# EAGLE design octanis_eps_compact (EAGLE 7.1.0)
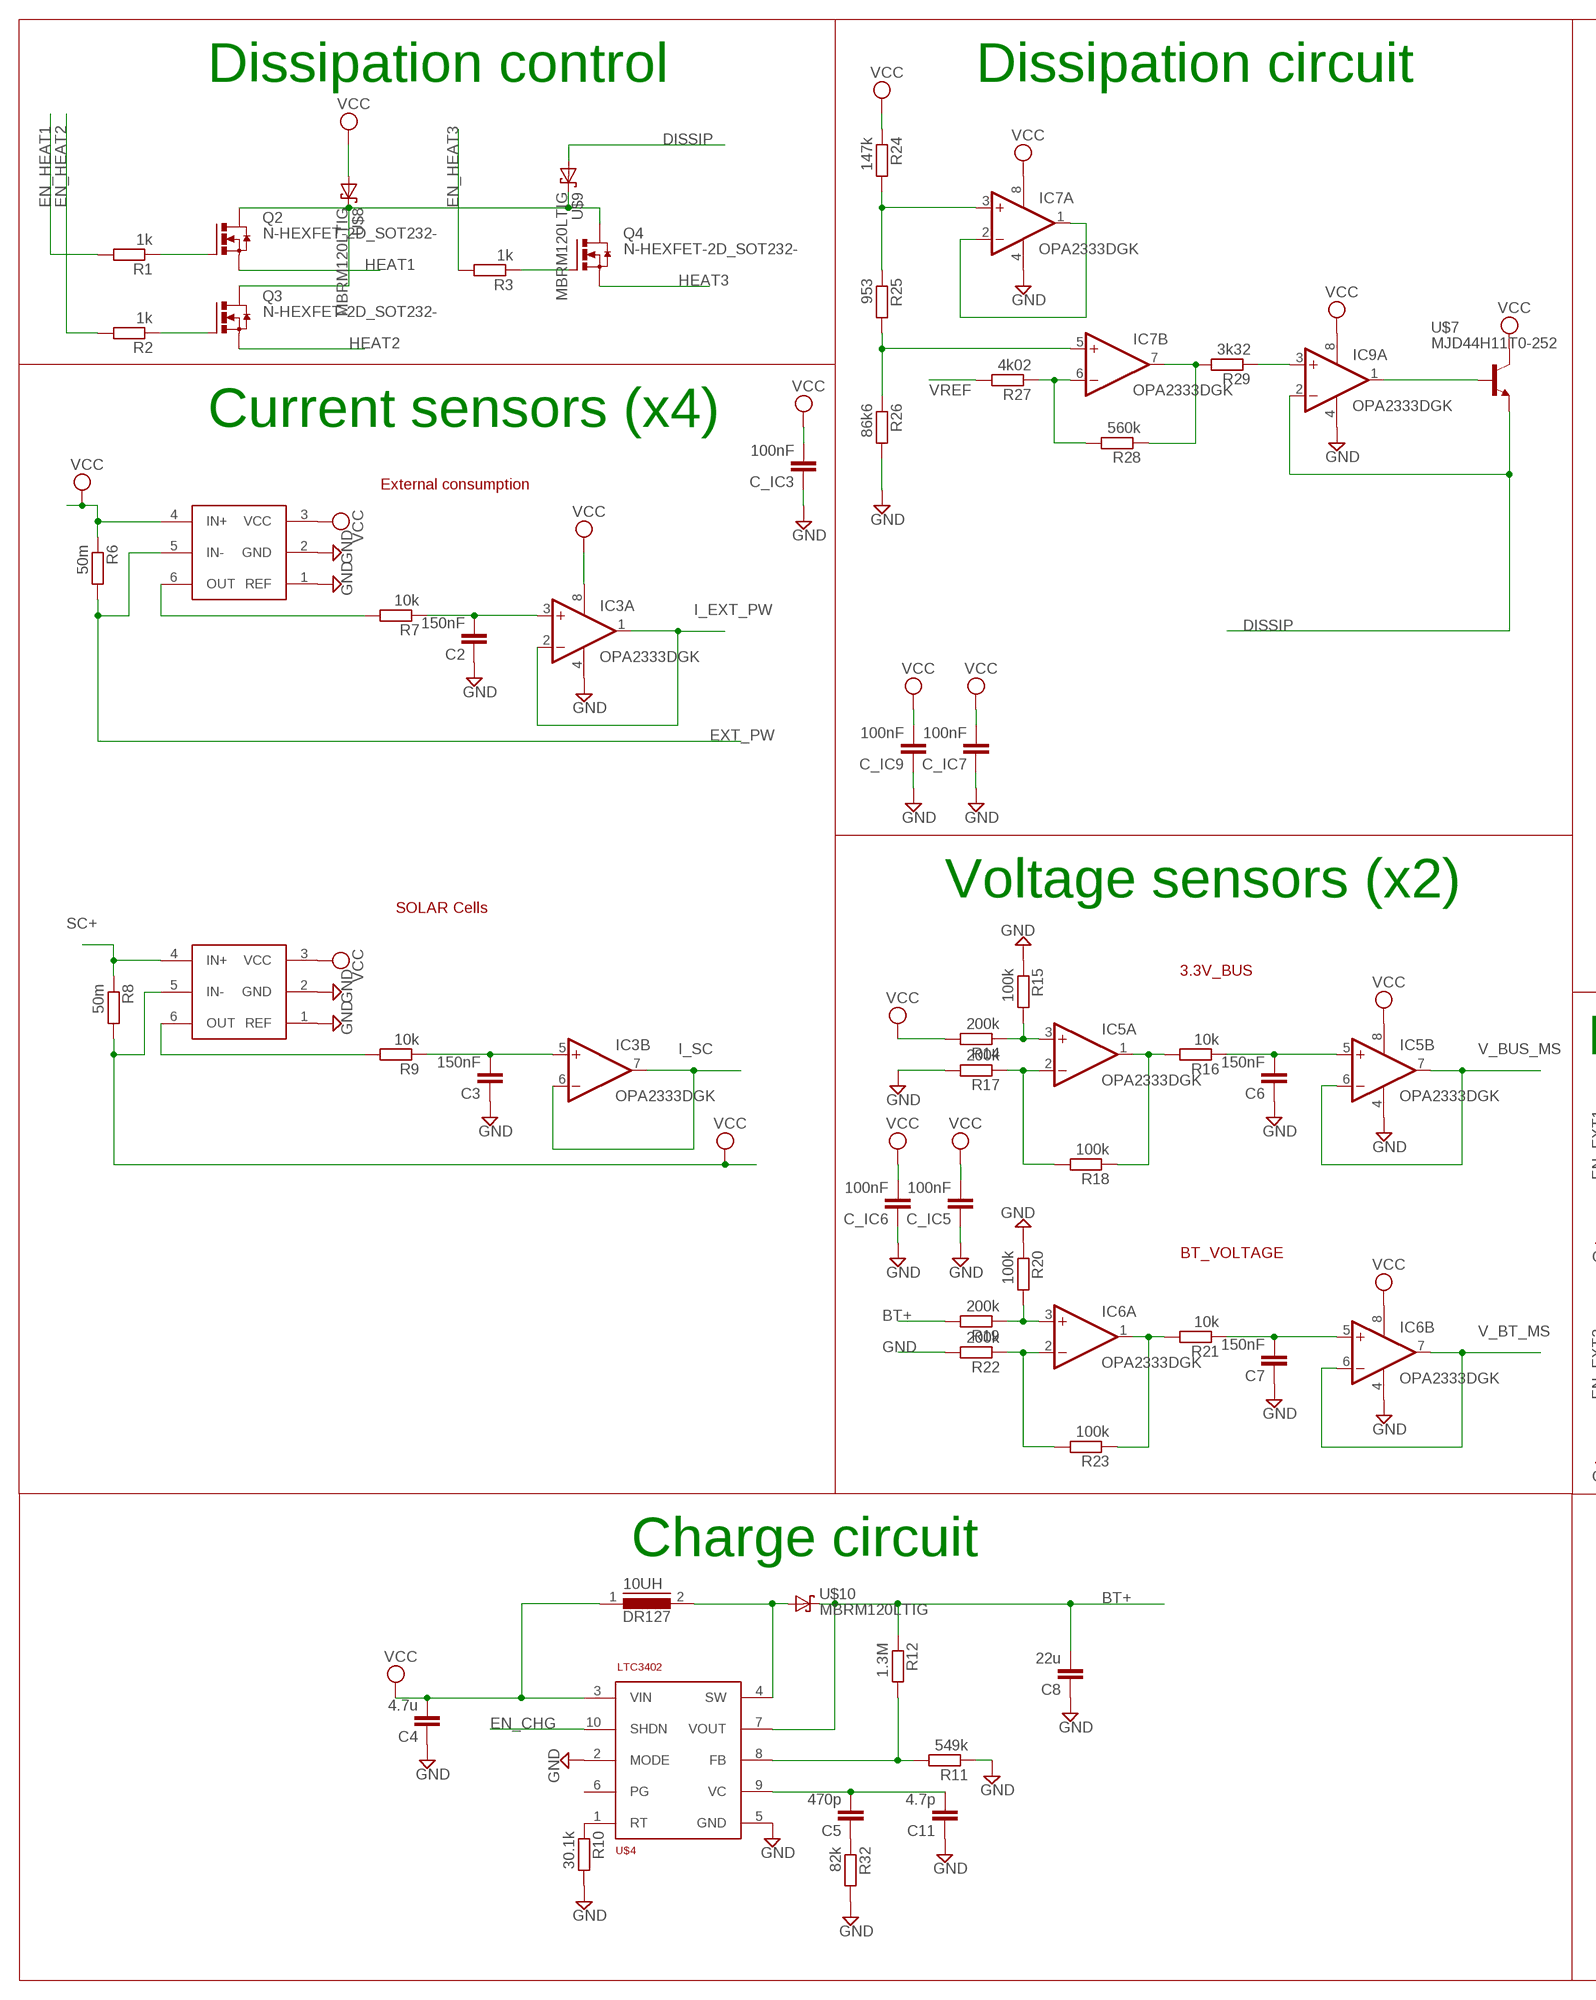
[diagram p0: schematic, sheet 1, part 1 of 2]
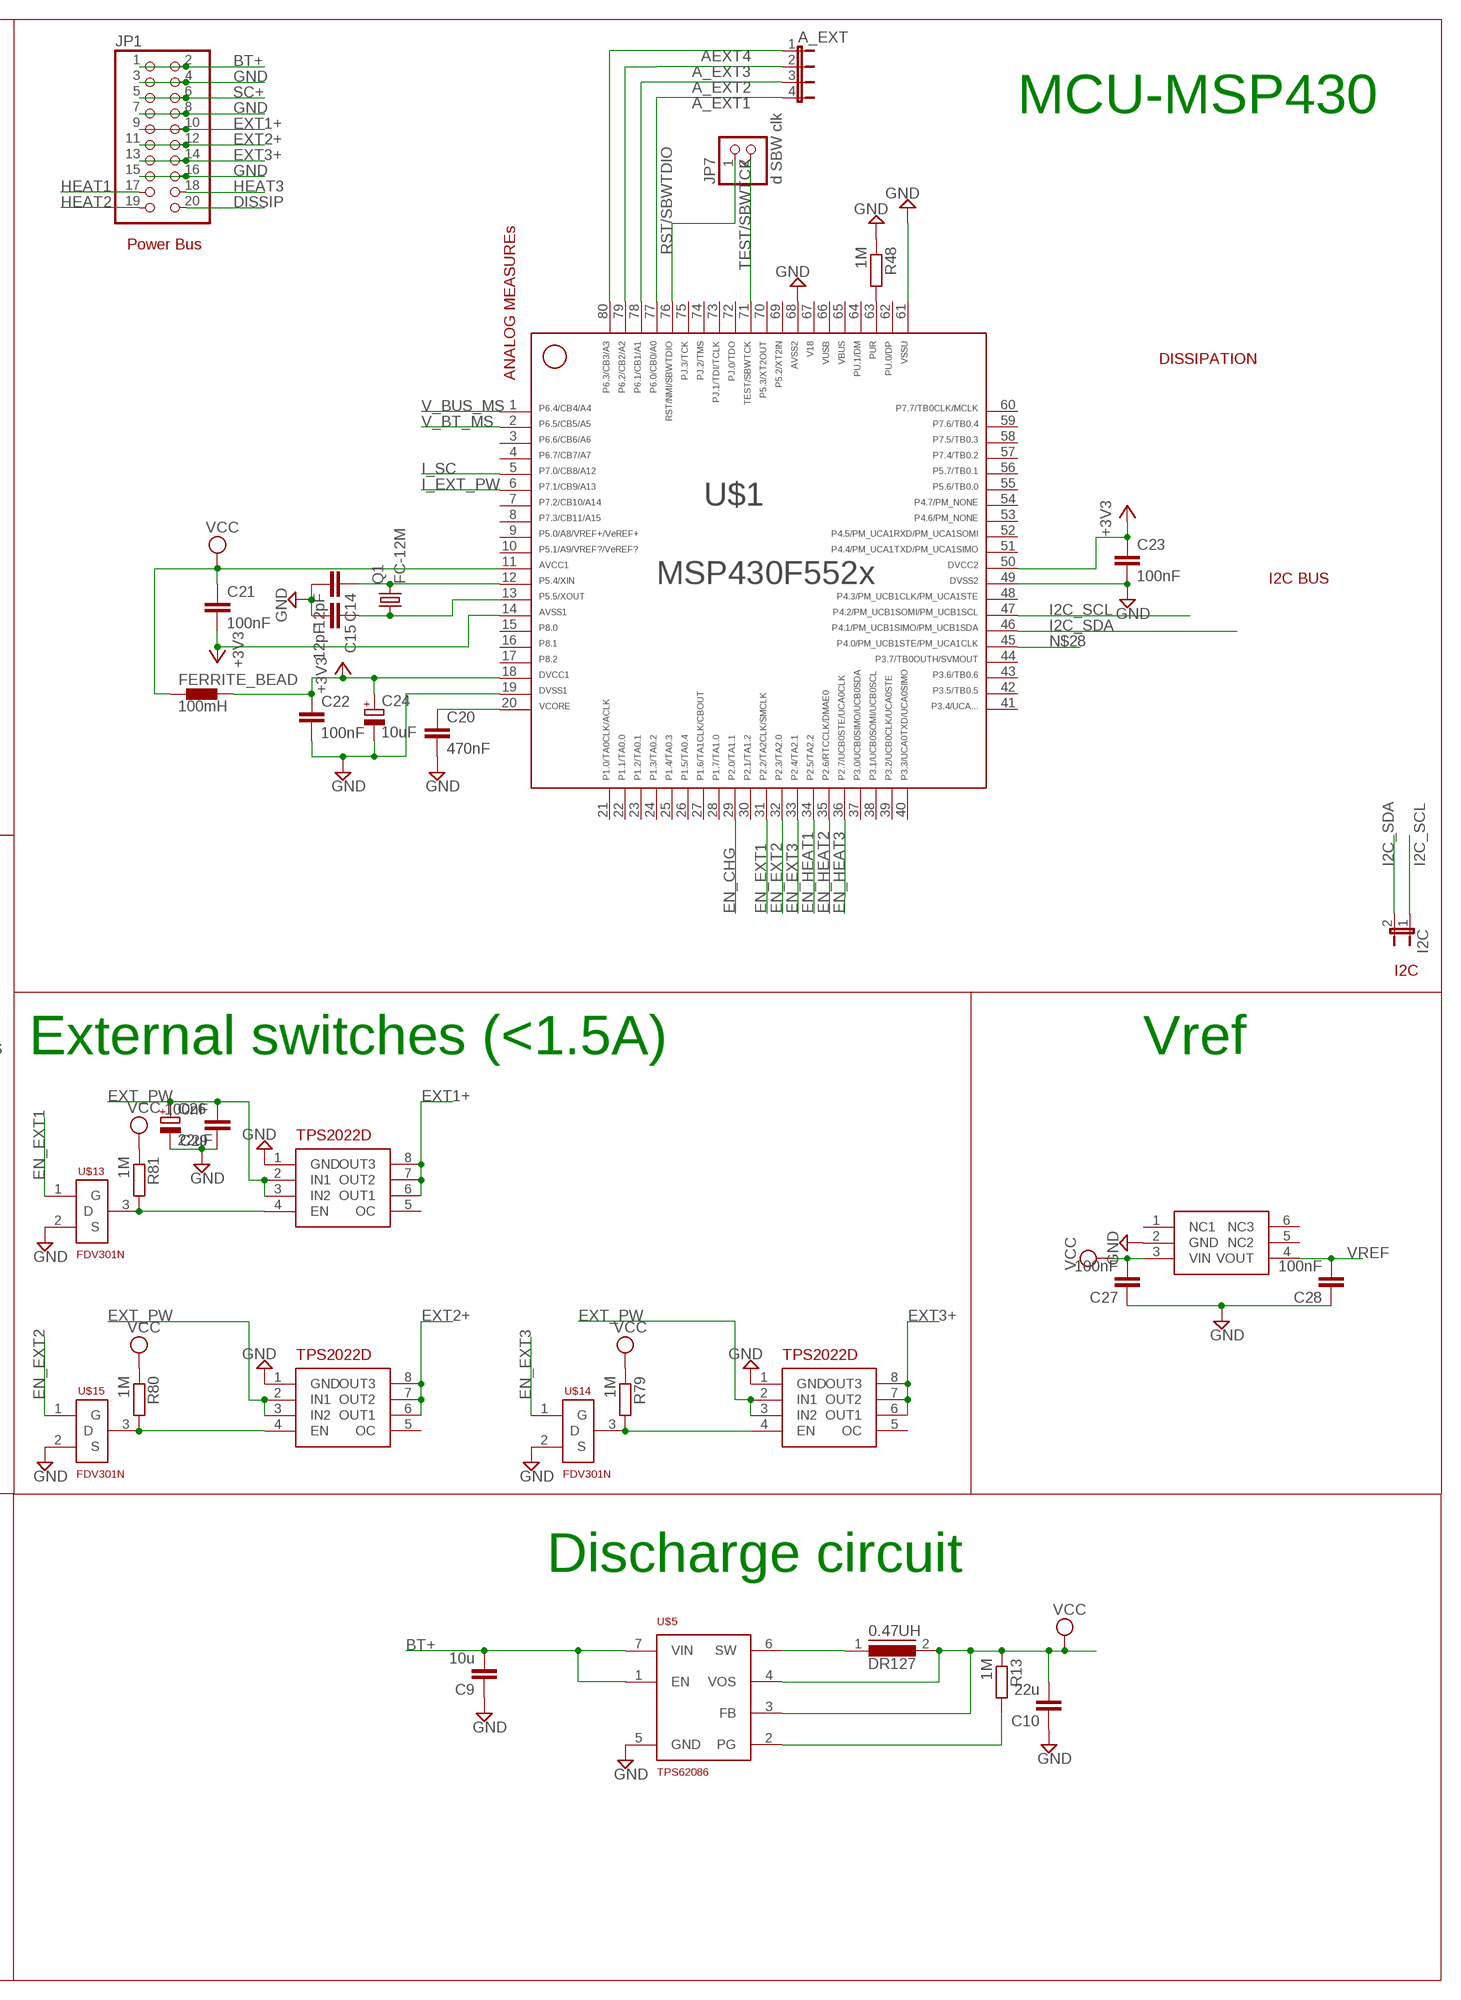
[diagram p1: schematic, sheet 1, part 2 of 2]

## Parts
0.47UH  DR127  [DR127]
10UH  DR127  [DR127]
A_EXT  JP4E  [JP4]
C2  150nF  C-EUC0603  [C0603]
C3  150nF  C-EUC0603  [C0603]
C4  4.7u  C-EUC1206  [C1206]
C5  470p  C-EUC0603  [C0603]
C6  150nF  C-EUC0603  [C0603]
C7  150nF  C-EUC0603  [C0603]
C8  22u  C-EUC0603  [C0603]
C9  10u  C-EUC1206  [C1206]
C10  22u  C-EUC1206  [C1206]
C11  4.7p  C-EUC0603  [C0603]
C14  12pF  C-EUC0603  [C0603]
C15  12pF  C-EUC0603  [C0603]
C20  470nF  C-EUC0603  [C0603]
C21  100nF  C-EUC0603  [C0603]
C22  100nF  C-EUC0603  [C0603]
C23  100nF  C-EUC0603  [C0603]
C24  10uF  CPOL-EUA/3216-18R  [A/3216-18R]
C26  22uF  CPOL-EUA/3216-18R  [A/3216-18R]
C27  100nF  C-EUC0603  [C0603]
C28  100nF  C-EUC0603  [C0603]
C29  100nF  C-EUC0603  [C0603]
C_IC3  100nF  C-EUC0603  [C0603]
C_IC5  100nF  C-EUC0603  [C0603]
C_IC6  100nF  C-EUC0603  [C0603]
C_IC7  100nF  C-EUC0603  [C0603]
C_IC9  100nF  C-EUC0603  [C0603]
FERRITE_BEAD  100mH  BLM15HD601SN1  [0402]
I2C  JP1E  [JP1]
IC3  OPA2333DGK  [MSOP08]
IC5  OPA2333DGK  [MSOP08]
IC6  OPA2333DGK  [MSOP08]
IC7  OPA2333DGK  [MSOP08]
IC9  OPA2333DGK  [MSOP08]
JP1  PINHD-2X10  [2X10]
JP7  d SBW clk  PINHD-1X2  [1X02]
Q1  FC-12M  [FC-12M]
Q2  N-HEXFET-2D_SOT232-  [SOT223]
Q3  N-HEXFET-2D_SOT232-  [SOT223]
Q4  N-HEXFET-2D_SOT232-  [SOT223]
R1  1k  R-EU_R0603  [R0603]
R2  1k  R-EU_R0603  [R0603]
R3  1k  R-EU_R0603  [R0603]
R6  50m  R-EU_R1206  [R1206]
R7  10k  R-EU_R0603  [R0603]
R8  50m  R-EU_R1206  [R1206]
R9  10k  R-EU_R0603  [R0603]
R10  30.1k  R-EU_R0603  [R0603]
R11  549k  R-EU_R0603  [R0603]
R12  1.3M  R-EU_R0603  [R0603]
R13  1M  R-EU_R0603  [R0603]
R14  200k  R-EU_R0603  [R0603]
R15  100k  R-EU_R0603  [R0603]
R16  10k  R-EU_R0603  [R0603]
R17  200k  R-EU_R0603  [R0603]
R18  100k  R-EU_R0603  [R0603]
R19  200k  R-EU_R0603  [R0603]
R20  100k  R-EU_R0603  [R0603]
R21  10k  R-EU_R0603  [R0603]
R22  200k  R-EU_R0603  [R0603]
R23  100k  R-EU_R0603  [R0603]
R24  147k  R-EU_R0603  [R0603]
R25  953  R-EU_R0603  [R0603]
R26  86k6  R-EU_R0603  [R0603]
R27  4k02  R-EU_R0603  [R0603]
R28  560k  R-EU_R0603  [R0603]
R29  3k32  R-EU_R0603  [R0603]
R32  82k  R-EU_R0603  [R0603]
R48  1M  R-EU_R0603  [R0603]
R79  1M  R-EU_R0603  [R0603]
R80  1M  R-EU_R0603  [R0603]
R81  1M  R-EU_R0603  [R0603]
U$1  F552X---PN80  [PN80]
U$2  INA213  [SC70-6]
U$3  INA213  [SC70-6]
U$4  LTC3402  [MSOP10]
U$5  TPS62086  [QFN-7]
U$7  MJD44H11T0-252  [TO252]
U$8  MBRM120LTIG  [DO216AA]
U$9  MBRM120LTIG  [DO216AA]
U$10  MBRM120LTIG  [DO216AA]
U$13  FDV301N  [SOT23]
U$14  FDV301N  [SOT23]
U$15  FDV301N  [SOT23]
U$16  TPS2022D  [SO8]
U$17  TPS2022D  [SO8]
U$18  TPS2022D  [SO8]
U$19  ADR127B  [TSOT23-6]

## Nets
+3V3: C21.2 C22.1 C23.1 C24.+ FERRITE_BEAD.2 U$1.14 U$1.18 U$1.50
A_EXT1: A_EXT.4 U$1.77
A_EXT2: A_EXT.3 U$1.78
A_EXT3: A_EXT.2 U$1.79
AEXT4: A_EXT.1 U$1.80
BT+: C8.2 C9.2 JP1.1 JP1.2 R12.1 R19.2 U$4.7(VOUT) U$5.1(EN) U$5.7(VIN) U$10.C(K)
DISSIP: IC9.2(A:-IN) JP1.20 U$7.3(E) U$9.A
EN_CHG: U$1.29 U$4.10(SHDN)
EN_EXT1: U$1.31 U$13.1(G)
EN_EXT2: U$1.32 U$15.1(G)
EN_EXT3: U$1.33 U$14.1(G)
EN_HEAT1: R1.2 U$1.34
EN_HEAT2: R2.2 U$1.35
EN_HEAT3: R3.2 U$1.36
EXT1+: JP1.9 JP1.10 U$16.6(OUT1) U$16.7(OUT2) U$16.8(OUT3)
EXT2+: JP1.11 JP1.12 U$17.6(OUT1) U$17.7(OUT2) U$17.8(OUT3)
EXT3+: JP1.13 JP1.14 U$18.6(OUT1) U$18.7(OUT2) U$18.8(OUT3)
EXT_PW: C26.+ C29.2 R6.2 U$2.5(IN-) U$16.2(IN1) U$16.3(IN2) U$17.2(IN1) U$17.3(IN2) U$18.2(IN1) U$18.3(IN2)
GND: C2.1 C3.1 C4.1 C6.1 C7.1 C8.1 C9.1 C10.1 C11.1 C14.2 C15.2 C20.2 C22.2 C23.2 C24.- C26.- C27.1 C28.1 C29.1 C_IC3.1 C_IC5.1 C_IC6.1 C_IC7.1 C_IC9.1 IC3.4(P:V-) IC5.4(P:V-) IC6.4(P:V-) IC7.4(P:V-) IC9.4(P:V-) JP1.3 JP1.4 JP1.7 JP1.8 JP1.15 JP1.16 R10.2 R11.1 R15.1 R17.2 R20.1 R22.2 R26.2 R32.2 R48.1 U$1.19 U$1.49 U$1.61 U$1.68 U$2.1(REF) U$2.2(GND) U$3.1(REF) U$3.2(GND) U$4.2(MODE) U$4.5(GND) U$5.5(GND) U$13.2(S) U$14.2(S) U$15.2(S) U$16.1(GND) U$17.1(GND) U$18.1(GND) U$19.2(GND)
HEAT1: JP1.17 Q2.3(S)
HEAT2: JP1.19 Q3.3(S)
HEAT3: JP1.18 Q4.3(S)
I2C_SCL: I2C.1 U$1.47
I2C_SDA: I2C.2 U$1.46
I_EXT_PW: IC3.1(A:OUT) IC3.2(A:-IN) U$1.6
I_SC: IC3.6(B:-IN) IC3.7(B:OUT) U$1.5
N$1: R7.2 U$2.6(OUT)
N$2: R9.2 U$3.6(OUT)
N$3: R10.1 U$4.1(RT)
N$4: C5.1 R32.1
N$5: Q2.2(D) Q2.4(D) Q3.2(D) Q3.4(D) Q4.2(D) Q4.4(D) U$8.C(K) U$9.C(K)
N$6: C2.2 IC3.3(A:+IN) R7.1
N$7: C3.2 IC3.5(B:+IN) R9.1
N$8: C5.2 C11.2 U$4.9(VC)
N$9: C7.2 IC6.5(B:+IN) R21.1
N$10: IC6.1(A:OUT) R21.2 R23.1
N$11: C6.2 IC5.5(B:+IN) R16.1
N$12: IC5.1(A:OUT) R16.2 R18.1
N$13: IC5.2(A:-IN) R17.1 R18.2
N$14: IC5.3(A:+IN) R14.1 R15.2
N$15: IC6.2(A:-IN) R22.1 R23.2
N$16: IC6.3(A:+IN) R19.1 R20.2
N$17: IC7.1(A:OUT) IC7.2(A:-IN)
N$18: IC7.3(A:+IN) R24.2 R25.1
N$19: IC7.5(B:+IN) R25.2 R26.1
N$20: IC7.6(B:-IN) R27.1 R28.2
N$21: IC7.7(B:OUT) R28.1 R29.2
N$22: IC9.3(A:+IN) R29.1
N$23: R11.2 R12.2 U$4.8(FB)
N$24: 10UH.2 U$4.4(SW) U$10.A
N$25: R13.2 U$5.2(PG)
N$26: 0.47UH.1 U$5.6(SW)
N$27: R48.2 U$1.63
N$28: U$1.45
N$29: Q2.1(G) R1.1
N$31: Q3.1(G) R2.1
N$34: R80.2 U$15.3(D) U$17.4(EN)
N$37: Q4.1(G) R3.1
N$45: IC9.1(A:OUT) U$7.1(B)
N$48: C14.1 Q1.2 U$1.12
N$49: C20.1 U$1.20
N$50: C15.1 Q1.1 U$1.13
N$79: R81.2 U$13.3(D) U$16.4(EN)
N$80: R79.2 U$14.3(D) U$18.4(EN)
RST/SBWTDIO: JP7.1 U$1.76
SC+: JP1.5 JP1.6 R8.1 U$3.4(IN+)
TEST/SBWTCK: JP7.2 U$1.71
V_BT_MS: IC6.6(B:-IN) IC6.7(B:OUT) U$1.2
V_BUS_MS: IC5.6(B:-IN) IC5.7(B:OUT) U$1.1
VCC: 0.47UH.2 10UH.1 C4.2 C10.2 C21.1 C27.2 C_IC3.2 C_IC5.2 C_IC6.2 C_IC7.2 C_IC9.2 FERRITE_BEAD.1 IC3.8(P:V+) IC5.8(P:V+) IC6.8(P:V+) IC7.8(P:V+) IC9.8(P:V+) R6.1 R8.2 R13.1 R14.2 R24.1 R79.1 R80.1 R81.1 U$1.11 U$2.3(VCC) U$2.4(IN+) U$3.3(VCC) U$3.5(IN-) U$4.3(VIN) U$5.3(FB) U$5.4(VOS) U$7.2(C) U$8.A U$19.3(VIN)
VREF: C28.2 R27.2 U$19.4(VOUT)
Unconnected: IC9.5(B:+IN) IC9.6(B:-IN) IC9.7(B:OUT) U$1.3 U$1.4 U$1.7 U$1.8 U$1.9 U$1.10 U$1.15 U$1.16 U$1.17 U$1.21 U$1.22 U$1.23 U$1.24 U$1.25 U$1.26 U$1.27 U$1.28 U$1.30 U$1.37 U$1.38 U$1.39 U$1.40 U$1.41 U$1.42 U$1.43 U$1.44 U$1.48 U$1.51 U$1.52 U$1.53 U$1.54 U$1.55 U$1.56 U$1.57 U$1.58 U$1.59 U$1.60 U$1.62 U$1.64 U$1.69 U$1.70 U$1.72 U$1.73 U$1.74 U$1.75 U$4.6(PG) U$16.5(OC) U$17.5(OC) U$18.5(OC) U$19.1(NC1) U$19.5(NC2) U$19.6(NC3)

## Notes on the sheet
- Dissipation control | Dissipation circuit
- MCU-MSP430
- Power Bus
- DISSIPATION
- ANALOG MEASUREs
- Current sensors (x4)
- External consumption
- I2C BUS
- Voltage sensors (x2)
- SOLAR Cells
- 3.3V_BUS | I2C
- External switches (<1.5A) | Vref
- BT_VOLTAGE
- Charge circuit | Discharge circuit

## Power pins joined to a net without a drawn wire
65: U$1.65
66: U$1.66
67: U$1.67

## Library data of the parts
0.47UH 10UH = inductors:DR127: High Power Density, High Efficiency, Shielded Inductors Source: coiltronics_dr_series.pdf
A_EXT = jumper:JP4E: JUMPER
C2-C11 C14 C15 C20-C23 C27-C29 C_IC3 C_IC5-C_IC7 C_IC9 = rcl:C-EU: CAPACITOR, European symbol
C24 C26 = rcl:CPOL-EU: POLARIZED CAPACITOR, European symbol
FERRITE_BEAD = inductors:BLM15H: EMIFIL (R) Chip Ferrite Bead for GHz Noise Source: http://www.murata.com/ Ferrite Bead BLM15H.pdf
I2C = jumper:JP1E: JUMPER
IC3 IC5-IC7 IC9 = linear:OPA2333: DUAL 1.8V, microPOWER CMOS OPERATIONAL AMPLIFIERS Zerø-Drift Series Source: Texas Instruments (Burr-Brown) .. U11 opa333 Operational Amp.pdf
JP1 = pinhead:PINHD-2X10: PIN HEADER
JP7 = pinhead:PINHD-1X2: PIN HEADER
Q1 = crystal:FC-12M: kHz RANGE CRYSTAL UNIT LOW PROFILE SMD Source: Epson Toyocom FC-12M.pdf
Q2-Q4 = transistor-power:N-HEXFET-2D_?-*: HEXFET® Power MOSFET 2 Drain connects http://www.irf.com/product-info/datasheets/data/irll014n.pdf
R1-R3 R6-R29 R32 R48 R79-R81 = rcl:R-EU_: RESISTOR, European symbol
U$1 = TI_MSP430_v16:F552X---PN80: ***MSP430F552X***PN80 http://www.ti.com/lit/gpn/msp430f5529 Rev1.0 06/2010 For F552X where X is 1,5,7,9
U$2 U$3 = Octanis1_EPS:INA213: Voltage Output, High or Low Side Measurement, Bi-Directional Zer ø -Drift Series Current-Shunt Monitor
U$4 = Octanis1_EPS:LTC3402: 1 LTC3402 3402fb 2A, 3MHz Micropower Synchronous Boost Converter
U$5 = Octanis1_EPS:TPS62086: 3-A Step-Down Converter with Hiccup Short Circuit Protection in 2x2 QFN Package Fixed 3.3V operation
U$7 = Octanis1_EPS:MJD44H11: MJD44H11, MJD45H11 Complementary power transistors
U$8-U$10 = Octanis1_EPS:MBRM120LTIG
U$13-U$15 = Octanis1_EPS:FDV301N: FDV301N Digital FET ,N-Channel
U$16-U$18 = Octanis1_EPS:TPS2022D: TEXAS INSTRUMENTS - TPS2022D - IC, 1.5A PWR DIST SWITCH 8SOIC
U$19 = Octanis1_EPS:ADR127B: ANALOG DEVICES - ADR127BUJZ-REEL7 - VOLTAGE REFERENCE, SERIES, 3.3V, TSOT-6

## Net classes
0 default: clearance 0.205 mm

## Board
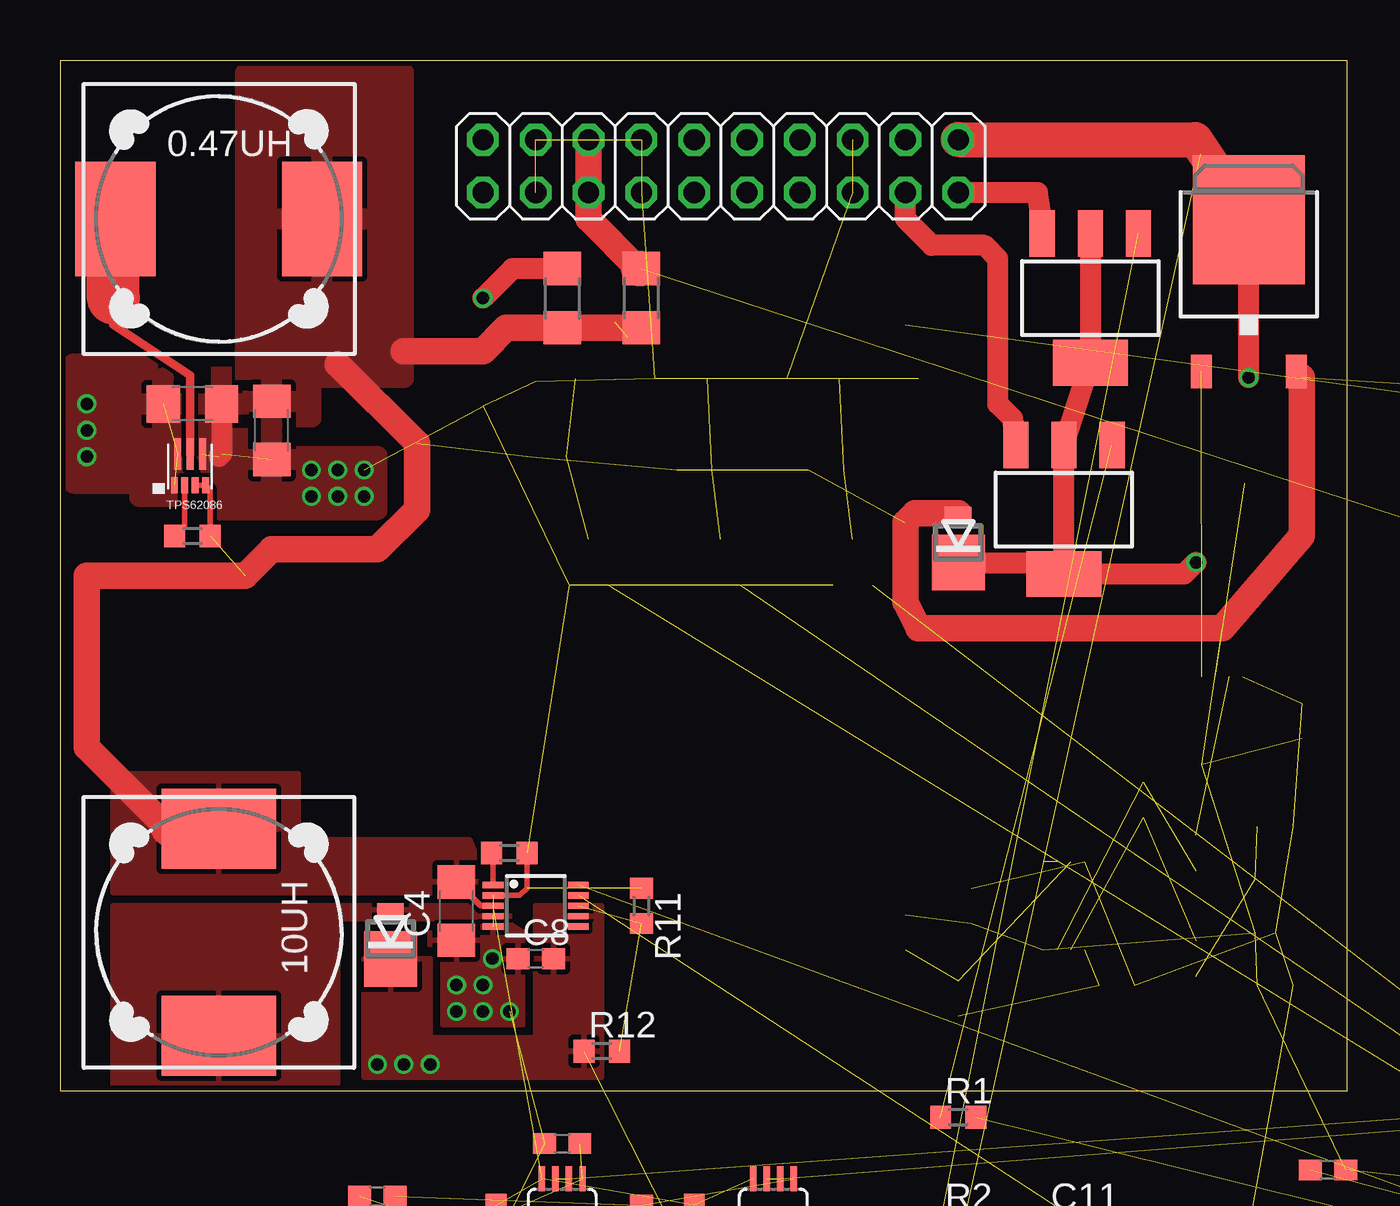
[diagram p2: board, top side]
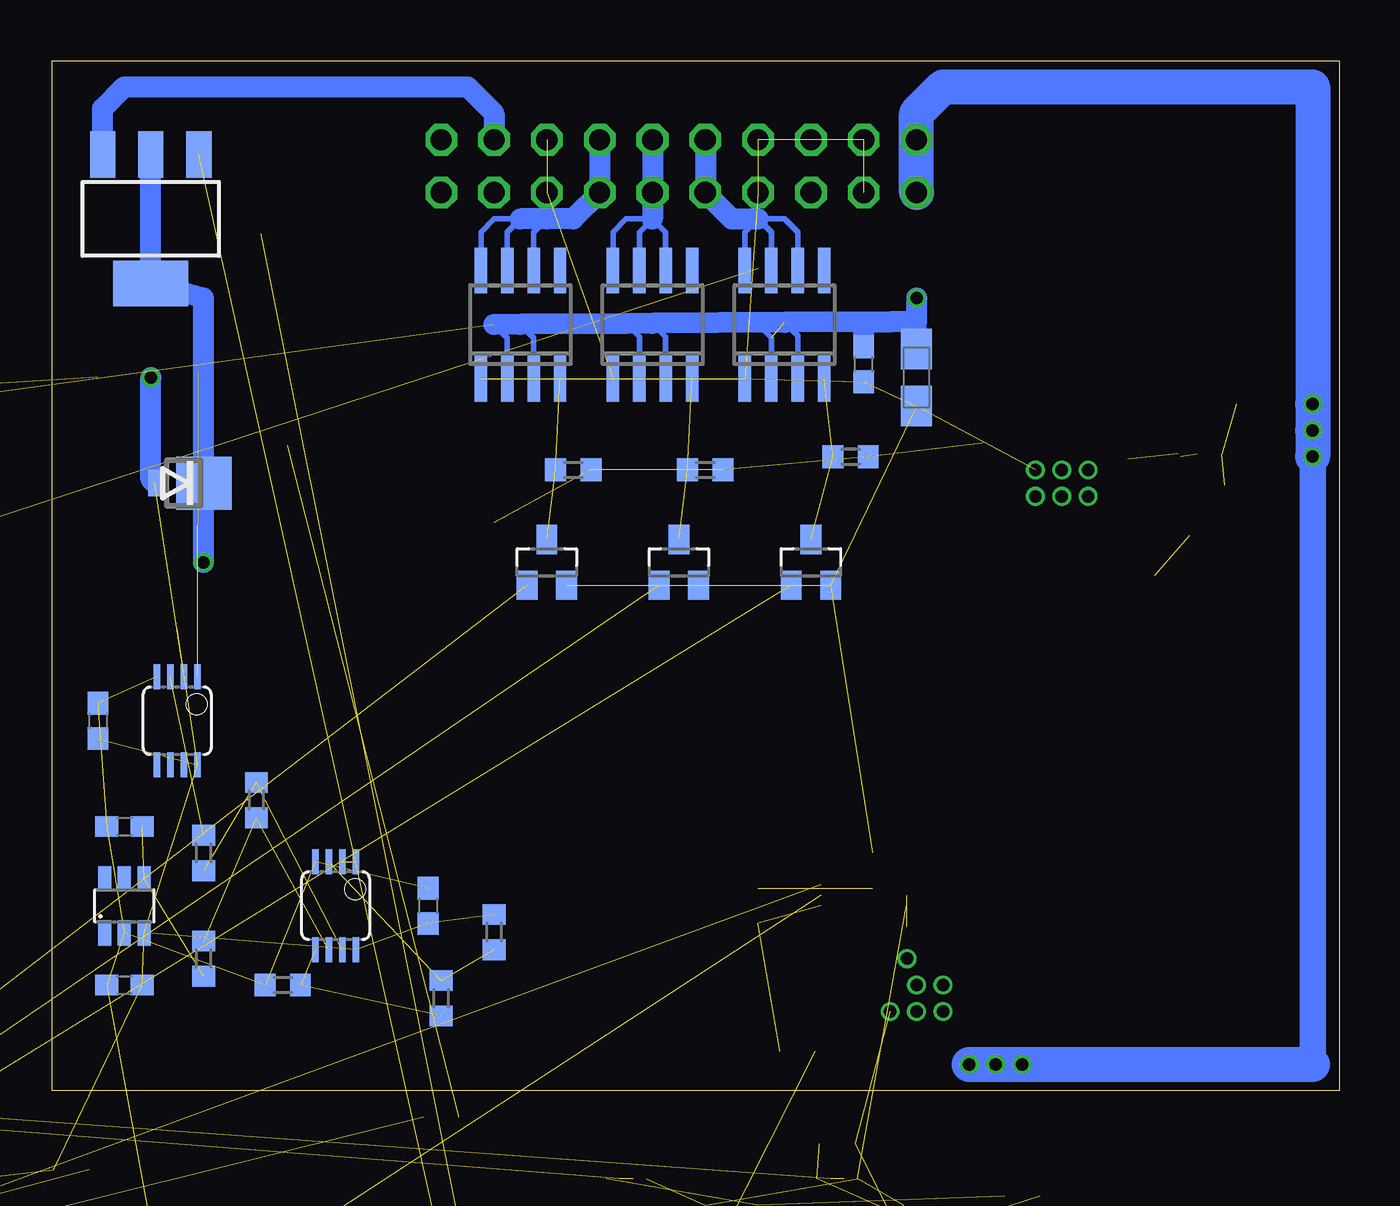
[diagram p3: board, bottom side, seen from below]

Size 61.9 x 49.52 mm. Coordinates in mm from the lower left corner, seen from the top.
Outline: 0,0 61.9,0 61.9,49.52 0,49.52 0,0
Copper layers (1*2*15*16): Top 0.035mm / dielectric 0.2mm / layer 2 0.0175mm / dielectric 1.1mm / layer 15 0.0175mm / dielectric 0.2mm / Bottom 0.035mm
Design rules "SeeedStudio_DRU_no_angle_20130527": minimum track width 6mil, minimum drill 12mil, track to track 6mil, track to pad 6mil, pad to pad 6mil, via to via 6mil, smd to smd 0mil, copper to edge 10mil, drill to drill 10mil, minimum pad ring 6mil, minimum via ring 6mil, stop-mask expansion 2mil, vias tented up to drill 25mil, thermal gap 10mil

### Footprints (pad centres in the part's own frame; a part is rotated, then mirrored left to right if it is on the bottom)
DR127 = smd 3.85 x 5.5: 1 -4.975,0; 2 4.975,0
JP4 = drill 0.914 long: 1 -3.81,0; 2 -1.27,0; 3 1.27,0; 4 3.81,0
C0603 = smd 1.1 x 1: 1 -0.85,0; 2 0.85,0
C1206 = smd 1.6 x 1.8: 1 -1.4,0; 2 1.4,0
A/3216-18R = smd 1.95 x 1.5: + 1.375,0; - -1.375,0
0402 = smd 0.7 x 0.9: 1 -0.65,0; 2 0.65,0
JP1 = drill 0.914 long: 1 0,-1.27; 2 0,1.27
MSOP08 = smd 0.3 x 1.2: 1 -0.976,-2.113; 2 -0.326,-2.113; 3 0.324,-2.113; 4 0.974,-2.113; 5 0.974,2.112; 6 0.324,2.112; 7 -0.326,2.112; 8 -0.976,2.112
2X10 = drill 1.016 octagon: 1 -11.43,-1.27; 2 -11.43,1.27; 3 -8.89,-1.27; 4 -8.89,1.27; 5 -6.35,-1.27; 6 -6.35,1.27; 7 -3.81,-1.27; 8 -3.81,1.27; 9 -1.27,-1.27; 10 -1.27,1.27; 11 1.27,-1.27; 12 1.27,1.27; 13 3.81,-1.27; 14 3.81,1.27; 15 6.35,-1.27; 16 6.35,1.27; 17 8.89,-1.27; 18 8.89,1.27; 19 11.43,-1.27; 20 11.43,1.27
1X02 = drill 1.016 long: 1 -1.27,0; 2 1.27,0
FC-12M = smd 0.7 x 1.4: 1 -0.85,0; 2 0.85,0
SOT223 = smd 1.219 x 2.235: 1 -2.311,-3.099; 2 0,-3.099; 3 2.311,-3.099 | smd 3.6 x 2.2: 4 0,3.099
R0603 = smd 1 x 1.1: 1 -0.85,0; 2 0.85,0
R1206 = smd 1.6 x 1.803: 1 -1.422,0; 2 1.422,0
PN80 = smd 1.35 x 0.3: 1 -6.825,4.75; 2 -6.825,4.25; 3 -6.825,3.75; 4 -6.825,3.25; 5 -6.825,2.75; 6 -6.825,2.25; 7 -6.825,1.75; 8 -6.825,1.25; 9 -6.825,0.75; 10 -6.825,0.25; 11 -6.825,-0.25; 12 -6.825,-0.75; 13 -6.825,-1.25; 14 -6.825,-1.75; 15 -6.825,-2.25; 16 -6.825,-2.75; 17 -6.825,-3.25; 18 -6.825,-3.75; 19 -6.825,-4.25; 20 -6.825,-4.75; 41 6.825,-4.75; 42 6.825,-4.25; 43 6.825,-3.75; 44 6.825,-3.25; 45 6.825,-2.75; 46 6.825,-2.25; 47 6.825,-1.75; 48 6.825,-1.25; 49 6.825,-0.75; 50 6.825,-0.25; 51 6.825,0.25; 52 6.825,0.75; 53 6.825,1.25; 54 6.825,1.75; 55 6.825,2.25; 56 6.825,2.75; 57 6.825,3.25; 58 6.825,3.75; 59 6.825,4.25; 60 6.825,4.75 | smd 0.3 x 1.35: 21 -4.75,-6.825; 22 -4.25,-6.825; 23 -3.75,-6.825; 24 -3.25,-6.825; 25 -2.75,-6.825; 26 -2.25,-6.825; 27 -1.75,-6.825; 28 -1.25,-6.825; 29 -0.75,-6.825; 30 -0.25,-6.825; 31 0.25,-6.825; 32 0.75,-6.825; 33 1.25,-6.825; 34 1.75,-6.825; 35 2.25,-6.825; 36 2.75,-6.825; 37 3.25,-6.825; 38 3.75,-6.825; 39 4.25,-6.825; 40 4.75,-6.825; 61 4.75,6.825; 62 4.25,6.825; 63 3.75,6.825; 64 3.25,6.825; 65 2.75,6.825; 66 2.25,6.825; 67 1.75,6.825; 68 1.25,6.825; 69 0.75,6.825; 70 0.25,6.825; 71 -0.25,6.825; 72 -0.75,6.825; 73 -1.25,6.825; 74 -1.75,6.825; 75 -2.25,6.825; 76 -2.75,6.825; 77 -3.25,6.825; 78 -3.75,6.825; 79 -4.25,6.825; 80 -4.75,6.825
SC70-6 = smd 0.35 x 0.8: 1 -0.65,-0.95; 2 0,-0.95; 3 0.65,-0.95; 4 0.65,0.95; 5 0,0.95; 6 -0.65,0.95
MSOP10 = smd 0.3 x 1: 1 -1,-2.05; 2 -0.5,-2.05; 3 0,-2.05; 4 0.5,-2.05; 5 1,-2.05; 6 1,2.05; 7 0.5,2.05; 8 0,2.05; 9 -0.5,2.05; 10 -1,2.05
QFN-7 = smd 0.33 x 0.762: 1 1.501,0.102; 2 1.001,0.102; 3 0.5,0.102; 4 0,0.102 | smd 0.33 x 1.524: 5 0.15,-1.397; 6 0.749,-1.397; 7 1.349,-1.397
TO252 = smd 1 x 1.6: 1 -2.28,-4.8; 2 2.28,-4.8 | smd 5.4 x 6.2: 3 0,2.5
DO216AA = smd 0.635 x 1.27: A 2.349,0 | smd 2.667 x 2.54: C -0.01,0
SOT23 = smd 1 x 1.4: 1 -0.95,-1.1; 2 0.95,-1.1; 3 0,1.1
SO8 = smd 0.6 x 2.2: 1 -1.905,-2.6; 2 -0.635,-2.6; 3 0.635,-2.6; 4 1.905,-2.6; 5 1.905,2.6; 6 0.635,2.6; 7 -0.635,2.6; 8 -1.905,2.6
TSOT23-6 = smd 0.62 x 1.22: 1 -0.95,-1.3; 2 0,-1.3; 3 0.95,-1.3; 4 0.95,1.3; 5 0,1.3; 6 -0.95,1.3

### Placement (x,y rotation side)
0.47UH  7.62,41.91 0 top
10UH  7.62,7.62 270 top
A_EXT  95.25,26.67 90 top  (outside the outline)
C2  92.71,22.86 270 bottom  (outside the outline)
C3  88.9,12.7 270 bottom  (outside the outline)
C4  19.05,8.64 90 top
C5  49.53,-10.16 0 top  (outside the outline)
C6  24.13,-2.54 0 top
C7  15.24,-5.08 0 top  (outside the outline)
C8  22.86,6.35 0 top
C9  6.35,33.02 180 top
C10  10.16,31.75 90 top
C11  48.26,-6.35 0 top  (outside the outline)
C14  72.39,-3.81 180 top  (outside the outline)
C15  71.12,-6.35 180 top  (outside the outline)
C20  76.2,-12.7 270 top  (outside the outline)
C21  60.96,-3.81 180 top  (outside the outline)
C22  71.12,-10.16 180 top  (outside the outline)
C23  96.52,-7.62 270 top  (outside the outline)
C24  73.66,-11.43 90 top  (outside the outline)
C26  20.32,34.29 90 bottom
C27  58.42,5.08 0 bottom
C28  58.42,12.7 0 bottom
C29  22.86,34.92 90 bottom
C_IC3  90.17,41.91 0 bottom  (outside the outline)
C_IC5  20.95,-6.35 90 top  (outside the outline)
C_IC6  30.48,-6.35 90 top  (outside the outline)
C_IC7  43.81,8.89 270 bottom
C_IC9  59.69,17.78 270 bottom
FERRITE_BEAD  67.31,-5.08 270 top  (outside the outline)
I2C  96.52,11.43 0 top  (outside the outline)
IC3  90.17,35.56 270 bottom  (outside the outline)
IC5  24.13,-6.35 0 top  (outside the outline)
IC6  34.29,-6.35 0 top  (outside the outline)
IC7  48.26,8.89 180 bottom
IC9  55.88,17.78 180 bottom
JP1  31.75,44.45 0 top
JP7  96.52,17.78 270 top  (outside the outline)
Q1  74.93,-5.08 90 top  (outside the outline)
Q2  48.26,27.94 180 top
Q3  49.53,38.1 180 top
Q4  57.15,41.91 180 bottom
R1  43.18,-1.27 0 top
R2  43.18,-6.35 0 top  (outside the outline)
R3  43.18,-11.43 0 top  (outside the outline)
R6  24.13,38.1 90 top
R7  85.09,25.4 90 bottom  (outside the outline)
R8  27.94,38.1 270 top
R9  88.9,26.67 90 bottom  (outside the outline)
R10  21.59,11.43 0 top
R11  27.94,8.89 270 top
R12  26.04,1.9 0 top
R13  6.35,26.67 180 top
R14  22.86,-17.78 0 top  (outside the outline)
R15  22.86,-15.24 180 top  (outside the outline)
R16  16.51,-8.89 270 top  (outside the outline)
R17  19.05,-17.78 180 top  (outside the outline)
R18  19.05,-15.24 0 top  (outside the outline)
R19  34.29,-17.78 0 top  (outside the outline)
R20  34.29,-15.24 180 top  (outside the outline)
R21  27.94,-6.35 270 top  (outside the outline)
R22  30.48,-17.78 180 top  (outside the outline)
R23  30.48,-15.24 0 top  (outside the outline)
R24  40.64,7.62 270 bottom
R25  43.18,4.44 270 bottom
R26  50.8,5.08 180 bottom
R27  54.61,6.35 270 bottom
R28  52.07,13.97 270 bottom
R29  54.61,11.43 270 bottom
R32  55.88,-8.89 0 top  (outside the outline)
R48  91.44,3.81 180 top  (outside the outline)
R79  36.83,29.85 180 bottom
R80  30.48,29.85 180 bottom
R81  23.5,30.48 180 bottom
U$1  85.09,-5.08 0 top  (outside the outline)
U$2  85.09,31.75 180 bottom  (outside the outline)
U$3  87.63,19.05 90 bottom  (outside the outline)
U$4  22.86,8.89 270 top
U$5  6.99,29.21 180 top
U$7  57.15,39.37 0 top
U$8  43.18,25.4 90 top
U$9  54.61,29.21 180 bottom
U$10  15.88,6.35 90 top
U$13  25.4,25.4 0 bottom
U$14  38.1,25.4 0 bottom
U$15  31.75,25.4 0 bottom
U$16  26.67,36.83 0 bottom
U$17  33.02,36.83 0 bottom
U$18  39.37,36.83 0 bottom
U$19  58.42,8.89 0 bottom

### Tracks (layer width: path | path; a pad name or v marks a point on that pad's centre or on a via)
+3V3  (7 unrouted)
A_EXT1  (1 unrouted)
A_EXT2  (1 unrouted)
A_EXT3  (1 unrouted)
AEXT4  (1 unrouted)
BT+  (via drill 0.6)  (3 unrouted)
  Bottom 1.016: JP1.1 JP1.2
  Bottom 1.27: 1.27,1.27 v1.27,30.48
  Bottom 1.676: JP1.1 20.32,46.99 19.05,48.26 1.27,48.26 v1.27,33.02 v1.27,31.75 v1.27,30.48 | 1.27,1.27 v15.24,1.27 v17.78,1.27
  other vias: 16.51,1.27
  pour Top: 0.64,29.21 3.81,29.21 3.81,28.57 5.71,28.57 5.71,33.66 4.45,34.92 0.64,34.92
  pour Top: 14.61,6.35 17.78,6.35 17.78,2.54 22.86,2.54 22.86,8.89 26.04,8.89 26.04,0.63 14.61,0.63
DISSIP  (via drill 0.6)  (1 unrouted)
  Top 1.016: v57.15,34.29 U$7.3
  Top 1.676: JP1.20 54.57,45.72 U$7.3
  Bottom 1.016: U$9.A 57.15,29.4 v57.15,34.29
EN_CHG  (1 unrouted)
EN_EXT1  (1 unrouted)
EN_EXT2  (1 unrouted)
EN_EXT3  (1 unrouted)
EN_HEAT1  (1 unrouted)
EN_HEAT2  (1 unrouted)
EN_HEAT3  (1 unrouted)
EXT1+
  Bottom 0.254: U$16.7 27.3,41.27 27.94,41.91 | U$16.8 28.57,41.27 27.94,41.91 | U$16.6 26.04,41.27 26.67,41.91 27.94,41.91
  Bottom 1.016: JP1.10 JP1.9 29.21,41.91 27.94,41.91
EXT2+
  Bottom 0.254: U$17.6 32.38,41.27 33.02,41.91 | U$17.7 33.66,41.27 33.02,41.91 | U$17.8 34.92,41.27 34.29,41.91 33.02,41.91
  Bottom 1.016: JP1.12 JP1.11 33.02,41.91
EXT3+
  Bottom 0.254: U$18.6 38.73,41.27 38.1,41.91 | U$18.7 40.01,41.27 39.37,41.91 40.64,41.91 41.27,41.27 U$18.8
  Bottom 1.016: JP1.14 JP1.13 36.83,41.91 38.1,41.91 39.37,41.91
EXT_PW  (via drill 0.6)  (2 unrouted)
  Top 1.016: R6.2 21.74,39.52 v20.32,38.1
  Bottom 0.254: U$16.3 26.04,36.31 26.67,36.94 | U$16.2 27.3,36.19 27.94,36.83 | U$17.3 32.38,36.25 33.02,36.89 | U$17.2 33.66,36.24 34.29,36.88 | U$18.3 38.73,36.19 39.37,36.83 39.37,36.84 | 39.37,36.84 | U$18.2 40.01,36.19 40.64,36.83
  Bottom 1.016: 20.3,36.97 21.59,36.96 | 21.59,36.96 26.67,36.94 33.02,36.89 34.29,36.88 39.37,36.84 40.64,36.83 | C26.+ 20.32,36.96 20.3,36.97 | C29.2 22.86,36.96 21.59,36.96 | v20.32,38.1 20.32,36.99 20.3,36.97
GND  (via drill 0.6)  (58 unrouted)
  Top 0.254: R10.2 22.44,9.74 22.09,9.39 U$4.2
  Top 1.016: C9.1 7.75,30.61 7.62,30.48
  other vias: 12.06,29.85 13.34,29.85 14.61,29.85 12.06,28.57 14.61,28.57 13.34,28.57 19.05,5.08 19.05,3.81 20.32,3.81 21.59,3.81 20.78,6.35 20.32,5.08
  pour Top: 6.35,34.29 7.62,27.94 15.24,27.94 15.24,30.48 11.43,30.48 11.43,34.29
  pour Top: 22.23,7.62 22.23,3.18 18.41,3.18 18.41,6.35 17.78,6.99 17.78,7.62 20.32,7.62 20.32,8.89
HEAT1
  Top 1.016: Q2.3 45.8,32.31 45.09,33.02 45.09,40 44.45,40.64 41.91,40.64 40.64,41.91 JP1.17
HEAT2
  Top 1.016: JP1.19 46.99,43.18 47.22,41.68 Q3.3
HEAT3
  Bottom 1.016: JP1.18 40.64,46.99 41.91,48.26 58.42,48.26 59.46,47.22 Q4.3
I2C_SCL  (1 unrouted)
I2C_SDA  (1 unrouted)
I_EXT_PW  (2 unrouted)
I_SC  (2 unrouted)
N$1  (1 unrouted)
N$2  (1 unrouted)
N$3
  Top 0.254: U$4.1 20.81,11.36 R10.1
N$4  (1 unrouted)
N$5  (via drill 0.6)
  Top 1.016: Q3.2 Q3.4 Q2.2 Q2.4 | U$8.C 47.71,25.39 Q2.4 | Q2.4 54.05,24.84 v54.61,25.4
  Bottom 1.016: Q4.2 Q4.4 54.61,38.1 v54.61,25.4 U$9.C
N$6  (2 unrouted)
N$7  (2 unrouted)
N$8  (2 unrouted)
N$9  (2 unrouted)
N$10  (2 unrouted)
N$11  (2 unrouted)
N$12  (2 unrouted)
N$13  (2 unrouted)
N$14  (2 unrouted)
N$15  (2 unrouted)
N$16  (2 unrouted)
N$17  (1 unrouted)
N$18  (2 unrouted)
N$19  (2 unrouted)
N$20  (2 unrouted)
N$21  (2 unrouted)
N$22  (1 unrouted)
N$23  (2 unrouted)
N$24
  pour Top: 21.59,8.89 2.54,8.89 2.54,0 13.34,0 13.34,8.25 21.59,8.25
N$25
  Top 0.254: R13.2 5.98,27.15 U$5.2
N$26
  Top 0.406: 2.54,38.1 2.54,36.83 6.24,34.4 U$5.6
  Top 2.54: 2.54,38.1 2.54,41.8 0.47UH.1
N$27  (1 unrouted)
N$29  (1 unrouted)
N$31  (1 unrouted)
N$34  (2 unrouted)
N$37  (1 unrouted)
N$45  (1 unrouted)
N$48  (2 unrouted)
N$49  (1 unrouted)
N$50  (2 unrouted)
N$79  (2 unrouted)
N$80  (2 unrouted)
RST/SBWTDIO  (1 unrouted)
SC+  (1 unrouted)
  Top 1.27: JP1.6 JP1.5 25.4,41.91 27.79,39.52
  Top 1.676: R8.1 27.79,39.52
TEST/SBWTCK  (1 unrouted)
V_BT_MS  (2 unrouted)
V_BUS_MS  (2 unrouted)
VCC  (26 unrouted)
  Top 0.254: R13.1 7.2,28.89 U$5.4 U$5.3 | U$4.3 20.2,8.89 C4.2
  Top 1.016: 59.69,34.31 U$7.2
  Top 1.27: R8.2 R6.1 21.44,36.68 20.32,35.56 16.51,35.56 | U$8.A 41.08,27.75 40.64,27.3 40.64,23.5 41.27,22.22 55.88,22.22 59.69,26.67 59.69,34.31 | 5.18,12.6 1.27,16.51 1.27,24.76 8.89,24.76 10.16,26.04 15.24,26.04 17.14,27.94 17.14,31.11 13.34,34.92
  Top 1.676: 10UH.1 5.18,12.6
  pour Top: 8.89,48.89 8.89,32.39 12.06,32.39 12.06,34.29 16.51,34.29 16.51,48.89
  pour Top: 20.95,8.89 20.32,8.25 20.32,9.53 2.54,9.53 2.54,15.24 11.43,15.24 11.43,12.07 19.68,12.07
VREF  (2 unrouted)

### Text on the board
tPlace: AN4 | AN3 | AN2 | AN1 | RST | TEST | SDA | SCL